# Altium schematic sheet EEPROM.SchDoc
size A
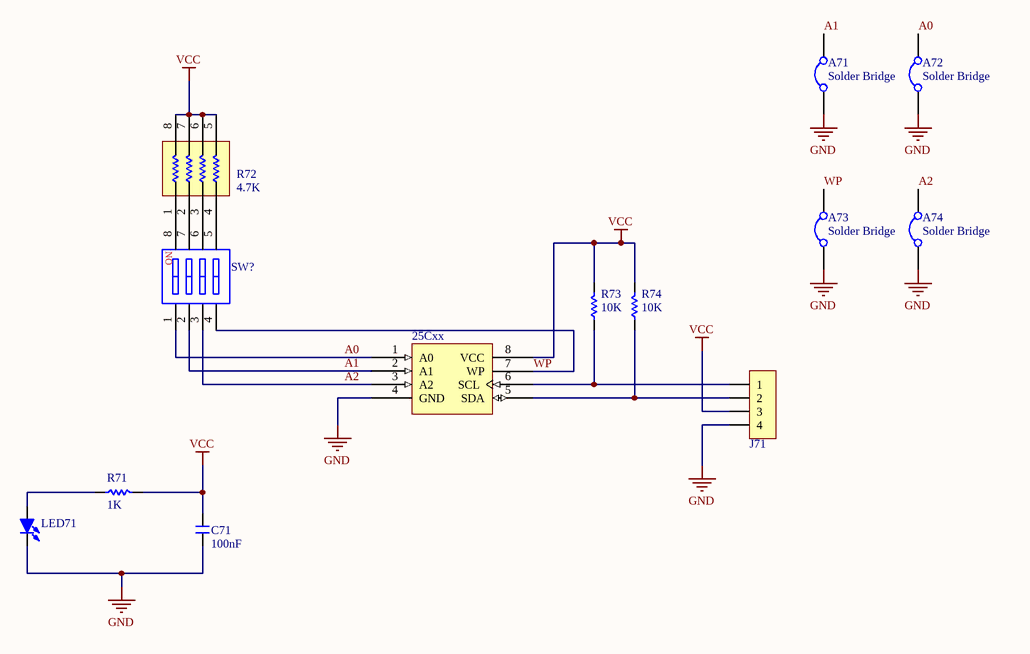
[diagram p0: EEPROM.SchDoc]

## Parts
25Cxx  24Cxx  [SOP8_L]  (value not drawn)
A71  Solder Bridge  [Solder Bridge Shorted]
A72  Solder Bridge  [Solder Bridge Shorted]
A73  Solder Bridge  [Solder Bridge Shorted]
A74  Solder Bridge  [Solder Bridge Shorted]
C71  100nF  [C 0805]
J71  HDR-1X4  [HDR-1X4]  (value not drawn)
LED71  LED-SMD  [LED 0805B]  (value not drawn)
R71  1K  [R 0805]
R72  4.7K  [RA1206 (4x0603)]
R73  10K  [R 0805]
R74  10K  [R 0805]
SW?  CSW-4P  [CSW1.27 SMD-4P]  (value not drawn)

## Nets
GND: 25Cxx.4(GND) A71.1 A72.1 A73.1 A74.1 C71.1 J71.4 LED71.2(K)
VCC: 25Cxx.8(VCC) C71.2 J71.3 R71.2 R72.5 R72.6 R72.7 R72.8 R73.2 R74.2
A0: 25Cxx.1(A0) A72.2 SW?.1
A1: 25Cxx.2(A1) A71.2 SW?.2
A2: 25Cxx.3(A2) A74.2 SW?.3
WP: 25Cxx.7(WP) A73.2 SW?.4
Net25Cxx_5: 25Cxx.5(SDA) J71.2 R74.1
Net25Cxx_6: 25Cxx.6(SCL) J71.1 R73.1
NetLED71_1: LED71.1(A) R71.1
NetR72_1: R72.1 SW?.8
NetR72_2: R72.2 SW?.7
NetR72_3: R72.3 SW?.6
NetR72_4: R72.4 SW?.5

## Notes on the sheet
- (in symbol CSW-4P) NO

## Library data of the parts
25Cxx = 24Cxx: Two-wire Serial EEPROM; BOM名称: 外置EEPROM; 版权归属: 源创客; 学习资源: www.ooocke.com
C71 = C: Non-polar patch capacitor; BOM名称: 无极性贴片电容; 版权归属: 源创客; 学习资源: www.ooocke.com
J71 = Header 4: 4P connector; BOM名称: 4P接插件; 版权归属: 源创客; 学习资源: www.ooocke.com
LED71 = LED-SMD: Patch LED; BOM名称: 贴片LED; 版权归属: 源创客; 学习资源: www.ooocke.com
R71 R73 R74 = R: Chip resistor; 版权归属: 源创客; BOM名称: Chip resistor; 学习资源: www.ooocke.com
R72 = R-ARR: 4 way Chip Resistor Array
SW? = CSW-4P: 4-way code switch; BOM名称: 4路编码开关; 版权归属: 源创客; 学习资源: www.ooocke.com